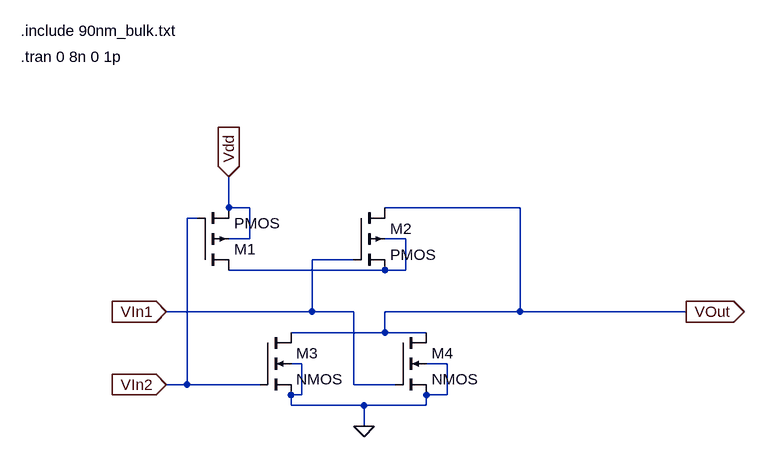
[diagram p0: schematic symb_or-no.asc]
symb_or-no.asc, the LTspice schematic file:
Version 4
SHEET 1 1028 680
WIRE 208 144 208 96
WIRE 240 144 208 144
WIRE 656 144 448 144
WIRE 160 160 144 160
WIRE 240 192 240 144
WIRE 240 192 208 192
WIRE 480 192 448 192
WIRE 400 224 336 224
WIRE 448 240 208 240
WIRE 480 240 480 192
WIRE 480 240 448 240
WIRE 336 304 336 224
WIRE 336 304 112 304
WIRE 400 304 336 304
WIRE 656 304 656 144
WIRE 656 304 448 304
WIRE 912 304 656 304
WIRE 448 336 448 304
WIRE 448 336 304 336
WIRE 512 336 448 336
WIRE 320 384 304 384
WIRE 544 384 512 384
WIRE 144 416 144 160
WIRE 144 416 112 416
WIRE 256 416 144 416
WIRE 400 416 400 304
WIRE 464 416 400 416
WIRE 320 432 320 384
WIRE 320 432 304 432
WIRE 544 432 544 384
WIRE 544 432 512 432
WIRE 304 448 304 432
WIRE 416 448 304 448
WIRE 512 448 512 432
WIRE 512 448 416 448
WIRE 416 480 416 448
FLAG 416 480 0
FLAG 112 304 VIn1
IOPIN 112 304 In
FLAG 112 416 VIn2
IOPIN 112 416 In
FLAG 912 304 VOut
IOPIN 912 304 Out
FLAG 208 96 Vdd
IOPIN 208 96 In
SYMBOL pmos4 160 240 M180
SYMATTR InstName M1
SYMATTR Value2 l=90n w=400n
SYMBOL pmos4 400 144 R0
SYMATTR InstName M2
SYMATTR Value2 l=90n w=400n
SYMBOL nmos4 256 336 R0
SYMATTR InstName M3
SYMATTR Value2 l=90n w=200n
SYMBOL nmos4 464 336 R0
SYMATTR InstName M4
SYMATTR Value2 l=90n w=200n
TEXT -112 -128 Left 2 !.include 90nm_bulk.txt
TEXT -112 -88 Left 2 !.tran 0 8n 0 1p

The netlist it stands for:
* symb_or-no.asc
M1 N001 VIn2 Vdd Vdd PMOS l=90n w=400n
M2 VOut VIn1 N001 N001 PMOS l=90n w=400n
M3 VOut VIn2 0 0 NMOS l=90n w=200n
M4 VOut VIn1 0 0 NMOS l=90n w=200n
.model NMOS NMOS
.model PMOS PMOS
.lib standard.mos
.include 90nm_bulk.txt
.tran 0 8n 0 1p
.backanno
.end